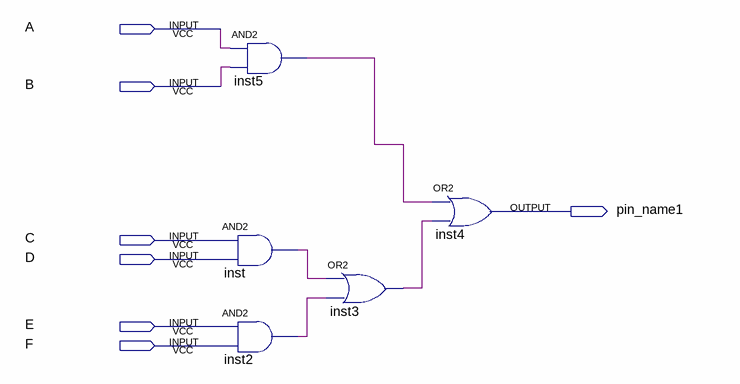
[diagram p0: schematic sheet]
// Quartus schematic testedanet.bdf.bdf as structural Verilog: 5 symbols, 7 pins
module \testedanet.bdf  (
  input  A,
  input  B,
  input  C,
  input  D,
  input  E,
  input  F,
  output pin_name1
);

  wire inst2_out, inst3_out, inst5_out, inst_out;

  and inst5 (inst5_out, A, B);
  and inst (inst_out, C, D);
  and inst2 (inst2_out, E, F);
  or inst3 (inst3_out, inst_out, inst2_out);
  or inst4 (pin_name1, inst5_out, inst3_out);
endmodule
